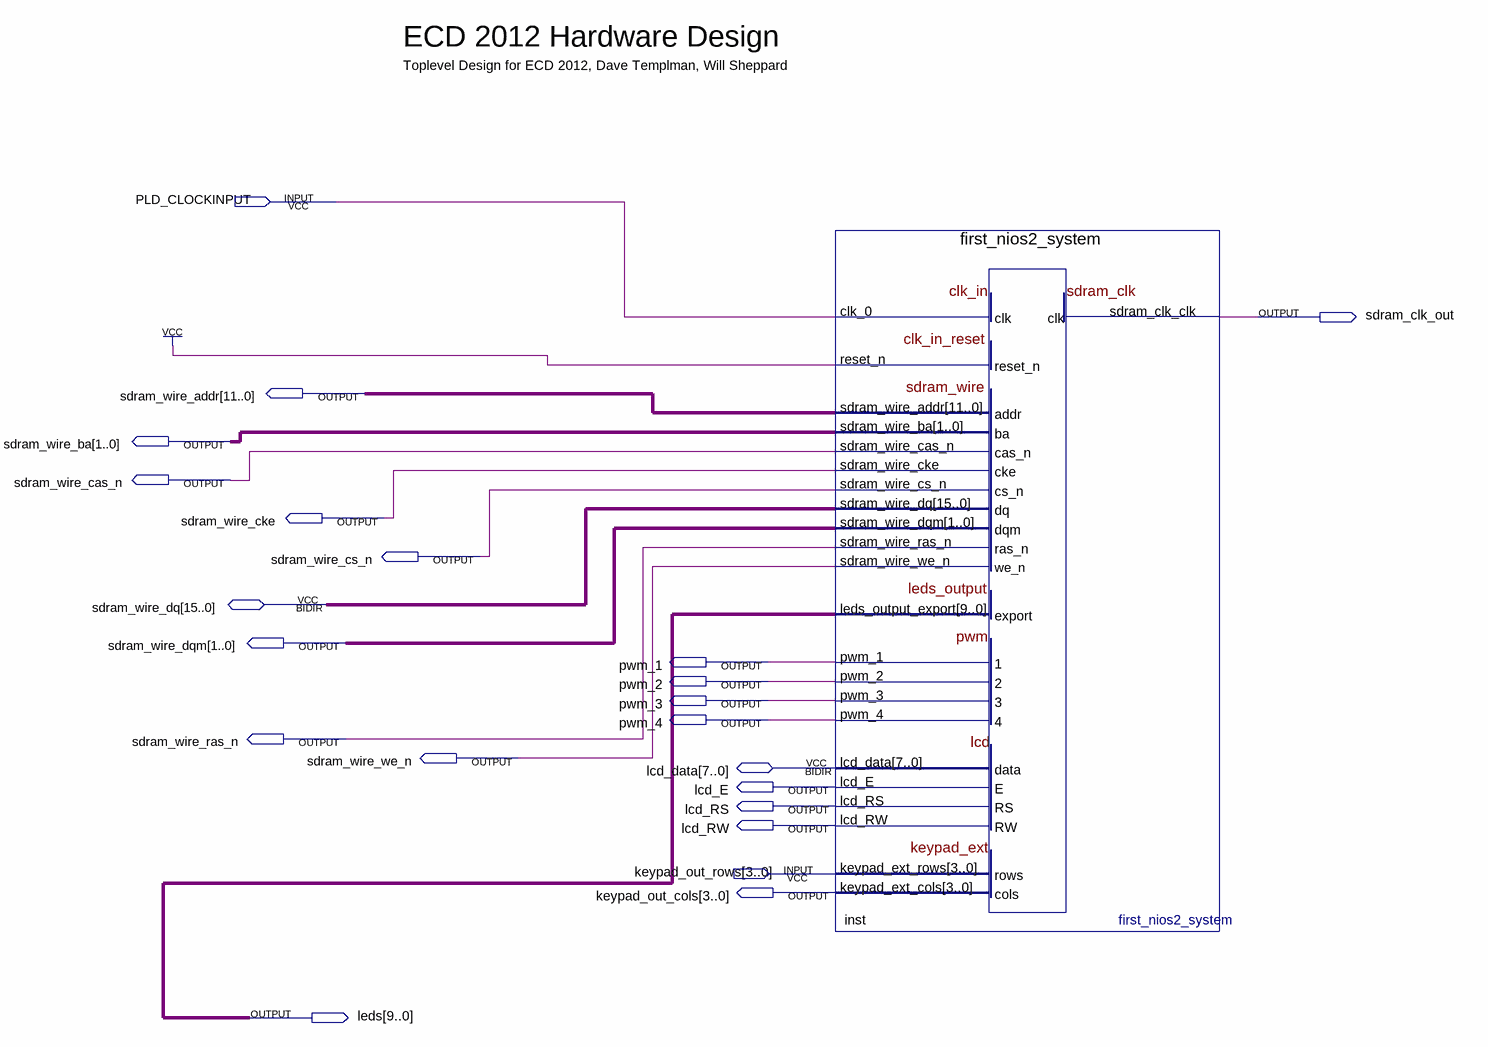
[diagram p0: schematic sheet]
// Quartus schematic nios2_quartus2_project.bdf as structural Verilog: 1 symbols, 22 pins
module nios2_quartus2_project (
  input  PLD_CLOCKINPUT,
  input  [3:0] keypad_out_rows,
  inout  [15:0] sdram_wire_dq,
  inout  [7:0] lcd_data,
  output sdram_clk_out,
  output [11:0] sdram_wire_addr,
  output [1:0] sdram_wire_ba,
  output sdram_wire_cas_n,
  output sdram_wire_cke,
  output sdram_wire_cs_n,
  output [1:0] sdram_wire_dqm,
  output pwm_1,
  output pwm_2,
  output pwm_3,
  output pwm_4,
  output sdram_wire_ras_n,
  output sdram_wire_we_n,
  output lcd_E,
  output lcd_RS,
  output lcd_RW,
  output [3:0] keypad_out_cols,
  output [9:0] leds
);

  first_nios2_system inst (
    .clk_0(PLD_CLOCKINPUT), .reset_n(1'b1), .keypad_ext_rows(keypad_out_rows),
    .sdram_wire_addr(sdram_wire_addr), .sdram_wire_ba(sdram_wire_ba), .sdram_wire_cas_n(sdram_wire_cas_n),
    .sdram_wire_cke(sdram_wire_cke), .sdram_wire_cs_n(sdram_wire_cs_n), .sdram_wire_dqm(sdram_wire_dqm),
    .sdram_wire_ras_n(sdram_wire_ras_n), .sdram_wire_we_n(sdram_wire_we_n), .sdram_clk_clk(sdram_clk_out),
    .leds_output_export(leds), .pwm_1(pwm_1), .pwm_2(pwm_2), .pwm_3(pwm_3), .pwm_4(pwm_4), .lcd_E(lcd_E),
    .lcd_RS(lcd_RS), .lcd_RW(lcd_RW), .keypad_ext_cols(keypad_out_cols), .sdram_wire_dq(sdram_wire_dq),
    .lcd_data(lcd_data));

  // Notes on the sheet:
  //   ECD 2012 Hardware Design
  //   Toplevel Design for ECD 2012, Dave Templman, Will Sheppard
endmodule
